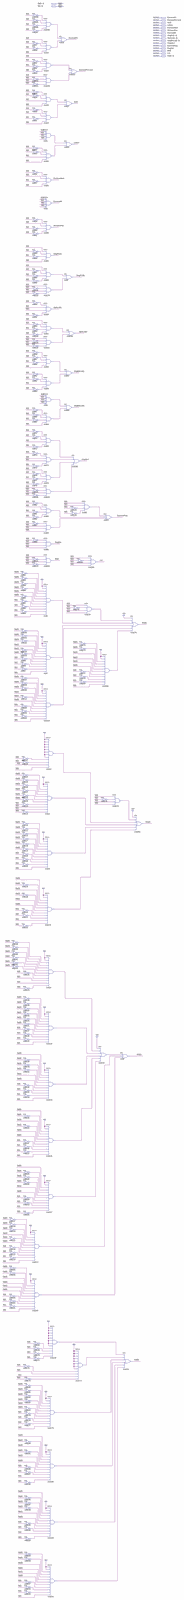
[diagram p0: schematic sheet, whole]
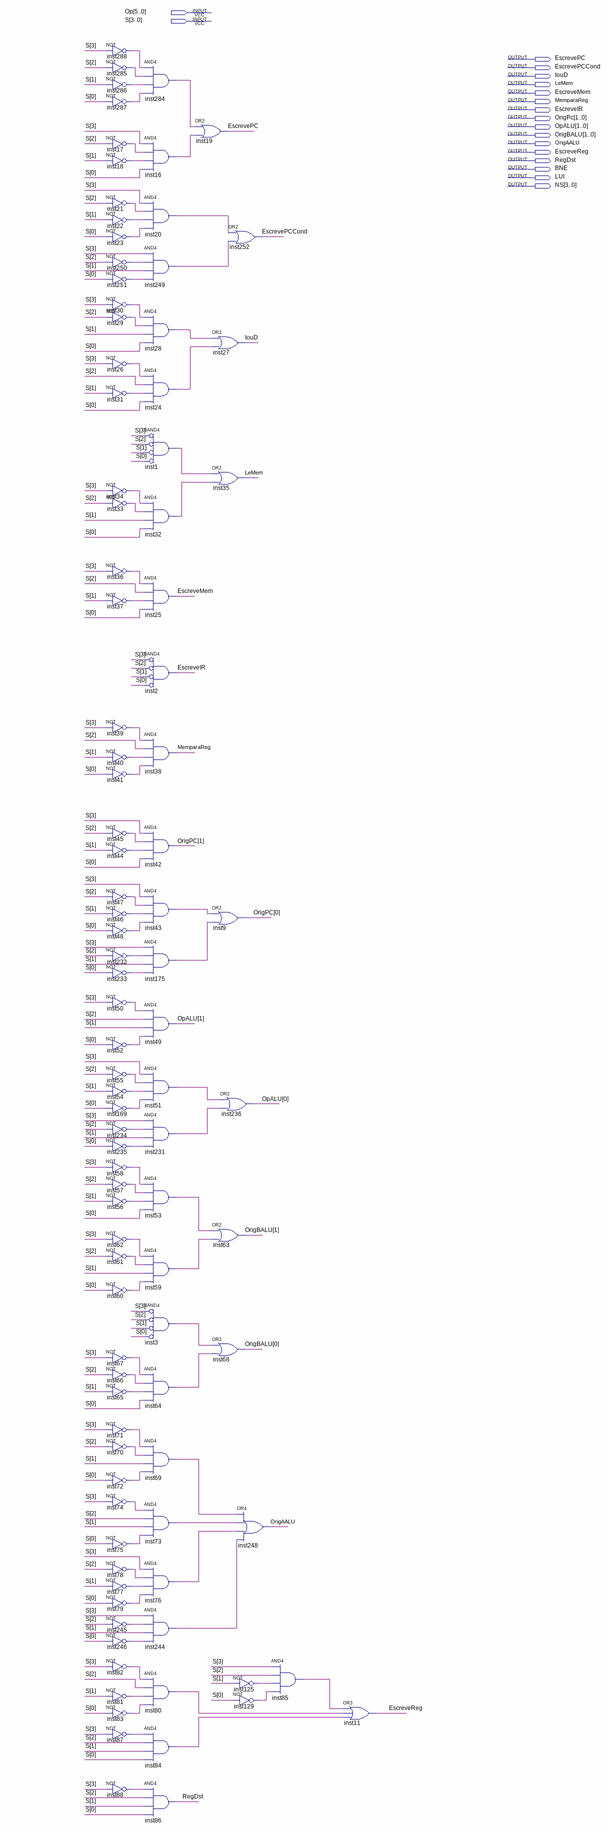
[diagram p1: schematic sheet, upper part]
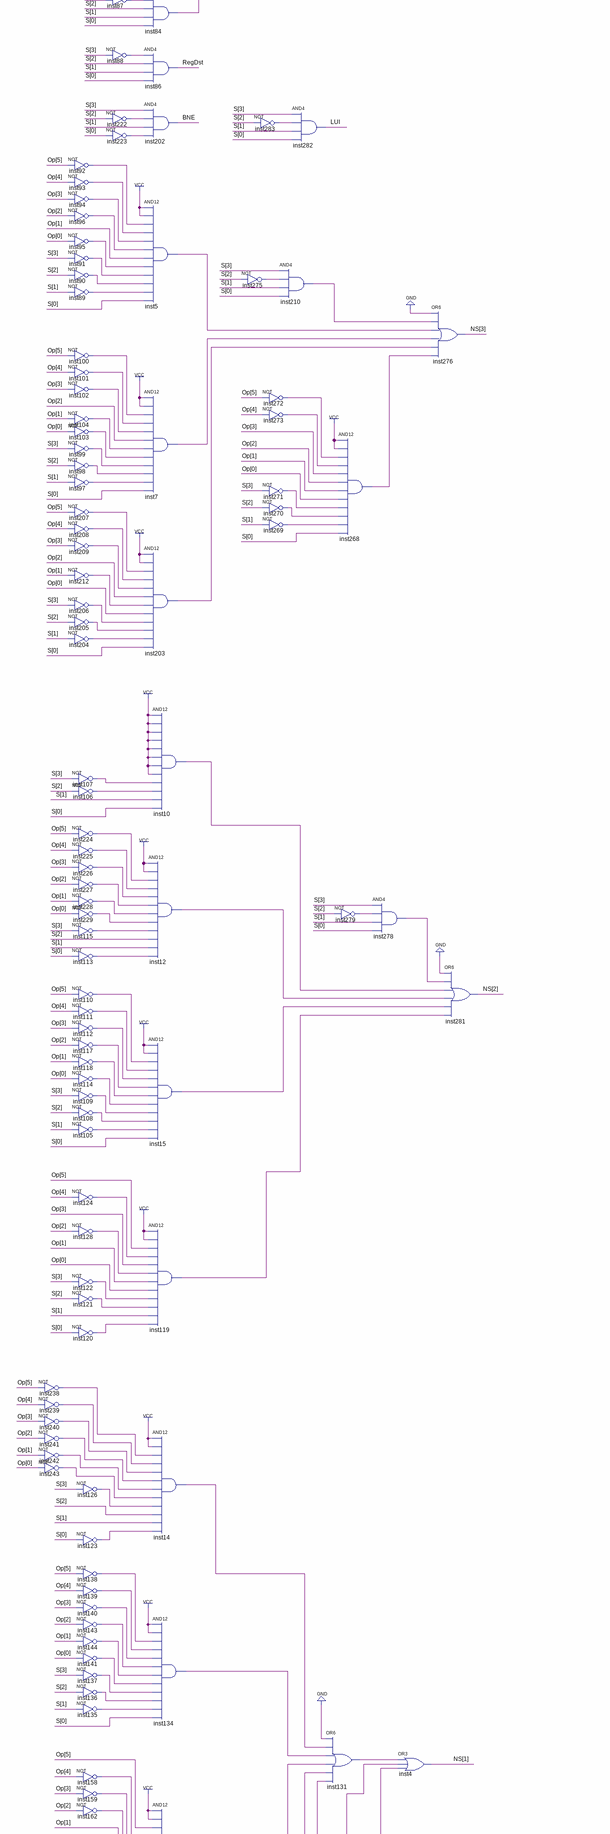
[diagram p2: schematic sheet, middle part]
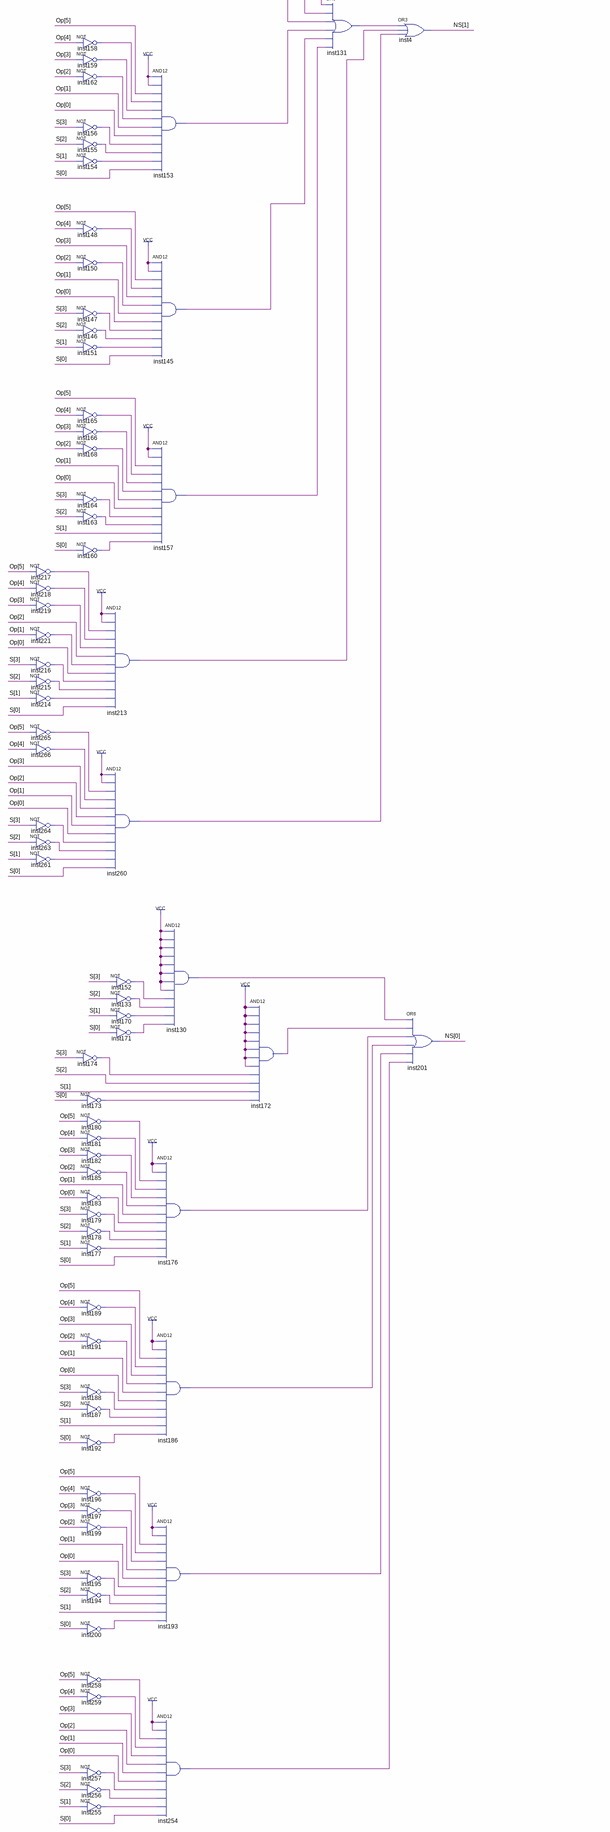
[diagram p3: schematic sheet, lower part]
// Quartus schematic contr_MEF.bdf as structural Verilog: 264 symbols, 18 pins
module contr_MEF (
  input  [5:0] Op,
  input  [3:0] S,
  output EscrevePC,
  output EscrevePCCond,
  output IouD,
  output LeMem,
  output EscreveMem,
  output MemparaReg,
  output EscreveIR,
  output [1:0] OrigPc,
  output [1:0] OpALU,
  output [1:0] OrigBALU,
  output OrigAALU,
  output EscreveReg,
  output RegDst,
  output BNE,
  output LUI,
  output [3:0] NS
);

  wire inst1_out, inst3_out, inst5_out, inst7_out, inst10_out, inst12_out, inst14_out, inst15_out,
       inst16_out, inst17_out, inst18_out, inst20_out, inst21_out, inst22_out, inst23_out, inst24_out,
       inst26_out, inst28_out, inst29_out, inst30_out, inst31_out, inst32_out, inst33_out, inst34_out,
       inst36_out, inst37_out, inst39_out, inst40_out, inst41_out, inst43_out, inst44_out, inst45_out,
       inst46_out, inst47_out, inst48_out, inst50_out, inst51_out, inst52_out, inst53_out, inst54_out,
       inst55_out, inst56_out, inst57_out, inst58_out, inst59_out, inst60_out, inst61_out, inst62_out,
       inst64_out, inst65_out, inst66_out, inst67_out, inst69_out, inst70_out, inst71_out, inst72_out,
       inst73_out, inst74_out, inst75_out, inst76_out, inst77_out, inst78_out, inst79_out, inst80_out,
       inst81_out, inst82_out, inst83_out, inst84_out, inst85_out, inst87_out, inst88_out, inst89_out,
       inst90_out, inst91_out, inst92_out, inst93_out, inst94_out, inst95_out, inst96_out, inst97_out,
       inst98_out, inst99_out, inst100_out, inst101_out, inst102_out, inst103_out, inst104_out, inst105_out,
       inst106_out, inst107_out, inst108_out, inst109_out, inst110_out, inst111_out, inst112_out,
       inst113_out, inst114_out, inst115_out, inst117_out, inst118_out, inst119_out, inst120_out,
       inst121_out, inst122_out, inst123_out, inst124_out, inst125_out, inst126_out, inst128_out,
       inst129_out, inst130_out, inst131_out, inst133_out, inst134_out, inst135_out, inst136_out,
       inst137_out, inst138_out, inst139_out, inst140_out, inst141_out, inst143_out, inst144_out,
       inst145_out, inst146_out, inst147_out, inst148_out, inst150_out, inst151_out, inst152_out,
       inst153_out, inst154_out, inst155_out, inst156_out, inst157_out, inst158_out, inst159_out,
       inst160_out, inst162_out, inst163_out, inst164_out, inst165_out, inst166_out, inst168_out,
       inst169_out, inst170_out, inst171_out, inst172_out, inst173_out, inst174_out, inst175_out,
       inst176_out, inst177_out, inst178_out, inst179_out, inst180_out, inst181_out, inst182_out,
       inst183_out, inst185_out, inst186_out, inst187_out, inst188_out, inst189_out, inst191_out,
       inst192_out, inst193_out, inst194_out, inst195_out, inst196_out, inst197_out, inst199_out,
       inst200_out, inst203_out, inst204_out, inst205_out, inst206_out, inst207_out, inst208_out,
       inst209_out, inst210_out, inst212_out, inst213_out, inst214_out, inst215_out, inst216_out,
       inst217_out, inst218_out, inst219_out, inst221_out, inst222_out, inst223_out, inst224_out,
       inst225_out, inst226_out, inst227_out, inst228_out, inst229_out, inst231_out, inst232_out,
       inst233_out, inst234_out, inst235_out, inst238_out, inst239_out, inst240_out, inst241_out,
       inst242_out, inst243_out, inst244_out, inst245_out, inst246_out, inst249_out, inst250_out,
       inst251_out, inst254_out, inst255_out, inst256_out, inst257_out, inst258_out, inst259_out,
       inst260_out, inst261_out, inst263_out, inst264_out, inst265_out, inst266_out, inst268_out,
       inst269_out, inst270_out, inst271_out, inst272_out, inst273_out, inst275_out, inst278_out,
       inst279_out, inst283_out, inst284_out, inst285_out, inst286_out, inst287_out, inst288_out;

  not inst238 (inst238_out, Op[5]);
  not inst239 (inst239_out, Op[4]);
  not inst240 (inst240_out, Op[3]);
  not inst241 (inst241_out, Op[2]);
  not inst242 (inst242_out, Op[1]);
  not inst243 (inst243_out, Op[0]);
  not inst217 (inst217_out, Op[5]);
  not inst218 (inst218_out, Op[4]);
  not inst219 (inst219_out, Op[3]);
  not inst221 (inst221_out, Op[1]);
  not inst216 (inst216_out, S[3]);
  not inst215 (inst215_out, S[2]);
  not inst214 (inst214_out, S[1]);
  not inst265 (inst265_out, Op[5]);
  not inst266 (inst266_out, Op[4]);
  not inst264 (inst264_out, S[3]);
  not inst263 (inst263_out, S[2]);
  not inst261 (inst261_out, S[1]);
  not inst92 (inst92_out, Op[5]);
  not inst93 (inst93_out, Op[4]);
  not inst94 (inst94_out, Op[3]);
  not inst96 (inst96_out, Op[2]);
  not inst95 (inst95_out, Op[0]);
  not inst91 (inst91_out, S[3]);
  not inst90 (inst90_out, S[2]);
  not inst89 (inst89_out, S[1]);
  not inst100 (inst100_out, Op[5]);
  not inst101 (inst101_out, Op[4]);
  not inst102 (inst102_out, Op[3]);
  not inst104 (inst104_out, Op[1]);
  not inst103 (inst103_out, Op[0]);
  not inst99 (inst99_out, S[3]);
  not inst98 (inst98_out, S[2]);
  not inst97 (inst97_out, S[1]);
  not inst207 (inst207_out, Op[5]);
  not inst208 (inst208_out, Op[4]);
  not inst209 (inst209_out, Op[3]);
  not inst212 (inst212_out, Op[1]);
  not inst206 (inst206_out, S[3]);
  not inst205 (inst205_out, S[2]);
  not inst204 (inst204_out, S[1]);
  not inst107 (inst107_out, S[3]);
  not inst106 (inst106_out, S[2]);
  not inst224 (inst224_out, Op[5]);
  not inst225 (inst225_out, Op[4]);
  not inst226 (inst226_out, Op[3]);
  not inst227 (inst227_out, Op[2]);
  not inst228 (inst228_out, Op[1]);
  not inst229 (inst229_out, Op[0]);
  not inst115 (inst115_out, S[3]);
  not inst113 (inst113_out, S[0]);
  not inst110 (inst110_out, Op[5]);
  not inst111 (inst111_out, Op[4]);
  not inst112 (inst112_out, Op[3]);
  not inst117 (inst117_out, Op[2]);
  not inst118 (inst118_out, Op[1]);
  not inst114 (inst114_out, Op[0]);
  not inst109 (inst109_out, S[3]);
  not inst108 (inst108_out, S[2]);
  not inst105 (inst105_out, S[1]);
  not inst124 (inst124_out, Op[4]);
  not inst128 (inst128_out, Op[2]);
  not inst122 (inst122_out, S[3]);
  not inst121 (inst121_out, S[2]);
  not inst120 (inst120_out, S[0]);
  not inst126 (inst126_out, S[3]);
  not inst123 (inst123_out, S[0]);
  not inst138 (inst138_out, Op[5]);
  not inst139 (inst139_out, Op[4]);
  not inst140 (inst140_out, Op[3]);
  not inst143 (inst143_out, Op[2]);
  not inst144 (inst144_out, Op[1]);
  not inst141 (inst141_out, Op[0]);
  not inst137 (inst137_out, S[3]);
  not inst136 (inst136_out, S[2]);
  not inst135 (inst135_out, S[1]);
  not inst158 (inst158_out, Op[4]);
  not inst159 (inst159_out, Op[3]);
  not inst162 (inst162_out, Op[2]);
  not inst156 (inst156_out, S[3]);
  not inst155 (inst155_out, S[2]);
  not inst154 (inst154_out, S[1]);
  not inst148 (inst148_out, Op[4]);
  not inst150 (inst150_out, Op[2]);
  not inst147 (inst147_out, S[3]);
  not inst146 (inst146_out, S[2]);
  not inst151 (inst151_out, S[1]);
  not inst165 (inst165_out, Op[4]);
  not inst166 (inst166_out, Op[3]);
  not inst168 (inst168_out, Op[2]);
  not inst164 (inst164_out, S[3]);
  not inst163 (inst163_out, S[2]);
  not inst160 (inst160_out, S[0]);
  not inst174 (inst174_out, S[3]);
  not inst173 (inst173_out, S[0]);
  not inst180 (inst180_out, Op[5]);
  not inst181 (inst181_out, Op[4]);
  not inst182 (inst182_out, Op[3]);
  not inst185 (inst185_out, Op[2]);
  not inst183 (inst183_out, Op[0]);
  not inst179 (inst179_out, S[3]);
  not inst178 (inst178_out, S[2]);
  not inst177 (inst177_out, S[1]);
  not inst189 (inst189_out, Op[4]);
  not inst191 (inst191_out, Op[2]);
  not inst188 (inst188_out, S[3]);
  not inst187 (inst187_out, S[2]);
  not inst192 (inst192_out, S[0]);
  not inst196 (inst196_out, Op[4]);
  not inst197 (inst197_out, Op[3]);
  not inst199 (inst199_out, Op[2]);
  not inst195 (inst195_out, S[3]);
  not inst194 (inst194_out, S[2]);
  not inst200 (inst200_out, S[0]);
  not inst258 (inst258_out, Op[5]);
  not inst259 (inst259_out, Op[4]);
  not inst257 (inst257_out, S[3]);
  not inst256 (inst256_out, S[2]);
  not inst255 (inst255_out, S[1]);
  not inst288 (inst288_out, S[3]);
  not inst285 (inst285_out, S[2]);
  not inst286 (inst286_out, S[1]);
  not inst287 (inst287_out, S[0]);
  not inst17 (inst17_out, S[2]);
  not inst18 (inst18_out, S[1]);
  not inst21 (inst21_out, S[2]);
  not inst22 (inst22_out, S[1]);
  not inst23 (inst23_out, S[0]);
  not inst250 (inst250_out, S[2]);
  not inst251 (inst251_out, S[0]);
  not inst30 (inst30_out, S[3]);
  not inst29 (inst29_out, S[2]);
  not inst26 (inst26_out, S[3]);
  not inst31 (inst31_out, S[1]);
  not inst34 (inst34_out, S[3]);
  not inst33 (inst33_out, S[2]);
  not inst36 (inst36_out, S[3]);
  not inst37 (inst37_out, S[1]);
  not inst39 (inst39_out, S[3]);
  not inst40 (inst40_out, S[1]);
  not inst41 (inst41_out, S[0]);
  not inst45 (inst45_out, S[2]);
  not inst44 (inst44_out, S[1]);
  not inst47 (inst47_out, S[2]);
  not inst46 (inst46_out, S[1]);
  not inst48 (inst48_out, S[0]);
  not inst232 (inst232_out, S[2]);
  not inst233 (inst233_out, S[0]);
  not inst50 (inst50_out, S[3]);
  not inst52 (inst52_out, S[0]);
  not inst55 (inst55_out, S[2]);
  not inst54 (inst54_out, S[1]);
  not inst169 (inst169_out, S[0]);
  not inst234 (inst234_out, S[2]);
  not inst235 (inst235_out, S[0]);
  not inst58 (inst58_out, S[3]);
  not inst57 (inst57_out, S[2]);
  not inst56 (inst56_out, S[1]);
  not inst62 (inst62_out, S[3]);
  not inst61 (inst61_out, S[2]);
  not inst60 (inst60_out, S[0]);
  not inst67 (inst67_out, S[3]);
  not inst66 (inst66_out, S[2]);
  not inst65 (inst65_out, S[1]);
  not inst71 (inst71_out, S[3]);
  not inst70 (inst70_out, S[2]);
  not inst72 (inst72_out, S[0]);
  not inst74 (inst74_out, S[3]);
  not inst75 (inst75_out, S[0]);
  not inst78 (inst78_out, S[2]);
  not inst77 (inst77_out, S[1]);
  not inst79 (inst79_out, S[0]);
  not inst245 (inst245_out, S[2]);
  not inst246 (inst246_out, S[0]);
  not inst82 (inst82_out, S[3]);
  not inst81 (inst81_out, S[1]);
  not inst83 (inst83_out, S[0]);
  not inst87 (inst87_out, S[3]);
  not inst88 (inst88_out, S[3]);
  not inst222 (inst222_out, S[2]);
  not inst223 (inst223_out, S[0]);
  and inst213 (inst213_out, 1'b1, 1'b1, inst217_out, inst218_out, inst219_out, Op[2], inst221_out, Op[0], inst216_out, inst215_out, inst214_out, S[0]);
  and inst260 (inst260_out, 1'b1, 1'b1, inst265_out, inst266_out, Op[3], Op[2], Op[1], Op[0], inst264_out, inst263_out, inst261_out, S[0]);
  not inst152 (inst152_out, S[3]);
  not inst133 (inst133_out, S[2]);
  not inst170 (inst170_out, S[1]);
  not inst171 (inst171_out, S[0]);
  and inst284 (inst284_out, inst288_out, inst285_out, inst286_out, inst287_out);
  and inst16 (inst16_out, S[3], inst17_out, inst18_out, S[0]);
  and inst20 (inst20_out, S[3], inst21_out, inst22_out, inst23_out);
  and inst249 (inst249_out, S[3], inst250_out, S[1], inst251_out);
  and inst28 (inst28_out, inst30_out, inst29_out, S[1], S[0]);
  and inst24 (inst24_out, inst26_out, S[2], inst31_out, S[0]);
  and inst1 (inst1_out, ~S[3], ~S[2], ~S[1], ~S[0]);  // BAND4
  and inst32 (inst32_out, inst34_out, inst33_out, S[1], S[0]);
  and inst25 (EscreveMem, inst36_out, S[2], inst37_out, S[0]);
  and inst2 (EscreveIR, ~S[3], ~S[2], ~S[1], ~S[0]);  // BAND4
  and inst38 (MemparaReg, inst39_out, S[2], inst40_out, inst41_out);
  and inst42 (OrigPc[1], S[3], inst45_out, inst44_out, S[0]);
  and inst43 (inst43_out, S[3], inst47_out, inst46_out, inst48_out);
  and inst175 (inst175_out, S[3], inst232_out, S[1], inst233_out);
  and inst49 (OpALU[1], inst50_out, S[2], S[1], inst52_out);
  and inst51 (inst51_out, S[3], inst55_out, inst54_out, inst169_out);
  and inst231 (inst231_out, S[3], inst234_out, S[1], inst235_out);
  and inst53 (inst53_out, inst58_out, inst57_out, inst56_out, S[0]);
  and inst59 (inst59_out, inst62_out, inst61_out, S[1], inst60_out);
  and inst3 (inst3_out, ~S[3], ~S[2], ~S[1], ~S[0]);  // BAND4
  and inst64 (inst64_out, inst67_out, inst66_out, inst65_out, S[0]);
  and inst69 (inst69_out, inst71_out, inst70_out, S[1], inst72_out);
  and inst73 (inst73_out, inst74_out, S[2], S[1], inst75_out);
  and inst76 (inst76_out, S[3], inst78_out, inst77_out, inst79_out);
  and inst244 (inst244_out, S[3], inst245_out, S[1], inst246_out);
  and inst80 (inst80_out, inst82_out, S[2], inst81_out, inst83_out);
  and inst84 (inst84_out, inst87_out, S[2], S[1], S[0]);
  and inst86 (RegDst, inst88_out, S[2], S[1], S[0]);
  and inst202 (BNE, S[3], inst222_out, S[1], inst223_out);
  and inst5 (inst5_out, 1'b1, 1'b1, inst92_out, inst93_out, inst94_out, inst96_out, Op[1], inst95_out, inst91_out, inst90_out, inst89_out, S[0]);
  and inst7 (inst7_out, 1'b1, 1'b1, inst100_out, inst101_out, inst102_out, Op[2], inst104_out, inst103_out, inst99_out, inst98_out, inst97_out, S[0]);
  and inst203 (inst203_out, 1'b1, 1'b1, inst207_out, inst208_out, inst209_out, Op[2], inst212_out, Op[0], inst206_out, inst205_out, inst204_out, S[0]);
  and inst10 (inst10_out, 1'b1, 1'b1, 1'b1, 1'b1, 1'b1, 1'b1, 1'b1, 1'b1, inst107_out, inst106_out, S[1], S[0]);
  and inst12 (inst12_out, 1'b1, 1'b1, inst224_out, inst225_out, inst226_out, inst227_out, inst228_out, inst229_out, inst115_out, S[2], S[1], inst113_out);
  and inst15 (inst15_out, 1'b1, 1'b1, inst110_out, inst111_out, inst112_out, inst117_out, inst118_out, inst114_out, inst109_out, inst108_out, inst105_out, S[0]);
  and inst119 (inst119_out, 1'b1, 1'b1, Op[5], inst124_out, Op[3], inst128_out, Op[1], Op[0], inst122_out, inst121_out, S[1], inst120_out);
  and inst14 (inst14_out, 1'b1, 1'b1, inst238_out, inst239_out, inst240_out, inst241_out, inst242_out, inst243_out, inst126_out, S[2], S[1], inst123_out);
  and inst134 (inst134_out, 1'b1, 1'b1, inst138_out, inst139_out, inst140_out, inst143_out, inst144_out, inst141_out, inst137_out, inst136_out, inst135_out, S[0]);
  and inst153 (inst153_out, 1'b1, 1'b1, Op[5], inst158_out, inst159_out, inst162_out, Op[1], Op[0], inst156_out, inst155_out, inst154_out, S[0]);
  and inst145 (inst145_out, 1'b1, 1'b1, Op[5], inst148_out, Op[3], inst150_out, Op[1], Op[0], inst147_out, inst146_out, inst151_out, S[0]);
  and inst157 (inst157_out, 1'b1, 1'b1, Op[5], inst165_out, inst166_out, inst168_out, Op[1], Op[0], inst164_out, inst163_out, S[1], inst160_out);
  and inst176 (inst176_out, 1'b1, 1'b1, inst180_out, inst181_out, inst182_out, inst185_out, Op[1], inst183_out, inst179_out, inst178_out, inst177_out, S[0]);
  and inst186 (inst186_out, 1'b1, 1'b1, Op[5], inst189_out, Op[3], inst191_out, Op[1], Op[0], inst188_out, inst187_out, S[1], inst192_out);
  and inst193 (inst193_out, 1'b1, 1'b1, Op[5], inst196_out, inst197_out, inst199_out, Op[1], Op[0], inst195_out, inst194_out, S[1], inst200_out);
  and inst254 (inst254_out, 1'b1, 1'b1, inst258_out, inst259_out, Op[3], Op[2], Op[1], Op[0], inst257_out, inst256_out, inst255_out, S[0]);
  or inst19 (EscrevePC, inst284_out, inst16_out);
  and inst130 (inst130_out, 1'b1, 1'b1, 1'b1, 1'b1, 1'b1, 1'b1, 1'b1, 1'b1, inst152_out, inst133_out, inst170_out, inst171_out);
  or inst252 (EscrevePCCond, inst20_out, inst249_out);
  or inst27 (IouD, inst28_out, inst24_out);
  or inst35 (LeMem, inst1_out, inst32_out);
  or inst9 (OrigPc[0], inst43_out, inst175_out);
  or inst236 (OpALU[0], inst51_out, inst231_out);
  or inst63 (OrigBALU[1], inst53_out, inst59_out);
  or inst68 (OrigBALU[0], inst3_out, inst64_out);
  or inst248 (OrigAALU, inst69_out, inst73_out, inst76_out, inst244_out);
  not inst125 (inst125_out, S[1]);
  not inst129 (inst129_out, S[0]);
  not inst283 (inst283_out, S[2]);
  not inst275 (inst275_out, S[2]);
  not inst272 (inst272_out, Op[5]);
  not inst273 (inst273_out, Op[4]);
  not inst271 (inst271_out, S[3]);
  not inst270 (inst270_out, S[2]);
  not inst269 (inst269_out, S[1]);
  and inst172 (inst172_out, 1'b1, 1'b1, 1'b1, 1'b1, 1'b1, 1'b1, 1'b1, 1'b1, inst174_out, S[2], S[1], inst173_out);
  and inst85 (inst85_out, S[3], S[2], inst125_out, inst129_out);
  and inst282 (LUI, S[3], inst283_out, S[1], S[0]);
  and inst210 (inst210_out, S[3], inst275_out, S[1], S[0]);
  or inst131 (inst131_out, 1'b0, inst14_out, inst134_out, inst153_out, inst145_out, inst157_out);
  or inst11 (EscreveReg, inst85_out, inst80_out, inst84_out);
  and inst268 (inst268_out, 1'b1, 1'b1, inst272_out, inst273_out, Op[3], Op[2], Op[1], Op[0], inst271_out, inst270_out, inst269_out, S[0]);
  not inst279 (inst279_out, S[2]);
  and inst278 (inst278_out, S[3], inst279_out, S[1], S[0]);
  or inst4 (NS[1], inst131_out, inst213_out, inst260_out);
  or inst276 (NS[3], 1'b0, inst210_out, inst5_out, inst7_out, inst203_out, inst268_out);
  or inst201 (NS[0], inst130_out, inst172_out, inst176_out, inst186_out, inst193_out, inst254_out);
  or inst281 (NS[2], 1'b0, inst278_out, inst10_out, inst12_out, inst15_out, inst119_out);
endmodule
